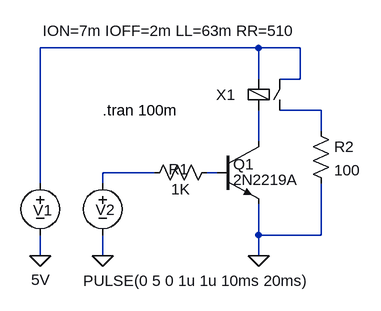
[diagram p0: schematic relais-test.asc]
relais-test.asc, the LTspice schematic file:
Version 4
SHEET 1 880 680
WIRE -304 128 -640 128
WIRE -240 128 -304 128
WIRE -304 176 -304 128
WIRE -240 176 -240 128
WIRE -240 176 -272 176
WIRE -208 224 -272 224
WIRE -208 256 -208 224
WIRE -304 272 -304 224
WIRE -464 320 -544 320
WIRE -368 320 -384 320
WIRE -640 336 -640 128
WIRE -544 336 -544 320
WIRE -304 416 -304 368
WIRE -208 416 -208 336
WIRE -208 416 -304 416
WIRE -640 448 -640 416
WIRE -544 448 -544 416
WIRE -304 448 -304 416
FLAG -640 448 0
FLAG -544 448 0
FLAG -304 448 0
SYMBOL voltage -640 320 R0
WINDOW 0 -11 58 Left 2
WINDOW 3 -14 165 Left 2
WINDOW 123 0 0 Left 2
WINDOW 39 0 0 Left 2
SYMATTR InstName V1
SYMATTR Value 5V
SYMBOL voltage -544 320 R0
WINDOW 0 -11 57 Left 2
WINDOW 3 -30 166 Left 2
WINDOW 123 0 0 Left 2
WINDOW 39 0 0 Left 2
SYMATTR InstName V2
SYMATTR Value PULSE(0 5 0 1u 1u 10ms 20ms)
SYMBOL res -368 304 R90
WINDOW 0 26 59 VBottom 2
WINDOW 3 26 56 VTop 2
SYMATTR InstName R1
SYMATTR Value 1K
SYMBOL npn -368 272 R0
WINDOW 0 25 35 Left 2
WINDOW 3 25 59 Left 2
SYMATTR InstName Q1
SYMATTR Value 2N2219A
SYMBOL res -224 240 R0
SYMATTR InstName R2
SYMATTR Value 100
SYMBOL relais -272 208 R0
WINDOW 39 -364 -106 Left 2
WINDOW 0 -97 -8 Left 2
SYMATTR SpiceLine ION=7m IOFF=2m LL=63m RR=510
SYMATTR InstName X1
TEXT -544 224 Left 2 !.tran 100m

The netlist it stands for:
* relais-test.asc
V1 N001 0 5V
V2 N004 0 PULSE(0 5 0 1u 1u 10ms 20ms)
R1 N005 N004 1K
Q1 N003 N005 0 0 2N2219A
R2 N002 0 100
XX1 N001 N003 N001 N002 relais params: ION=7m IOFF=2m LL=63m RR=510  ; pins 1 2 3 4
.model NPN NPN
.model PNP PNP
.lib standard.bjt
.tran 100m
.backanno
.end